# EAGLE schematic GEWI-base (EAGLE 7.6.0)
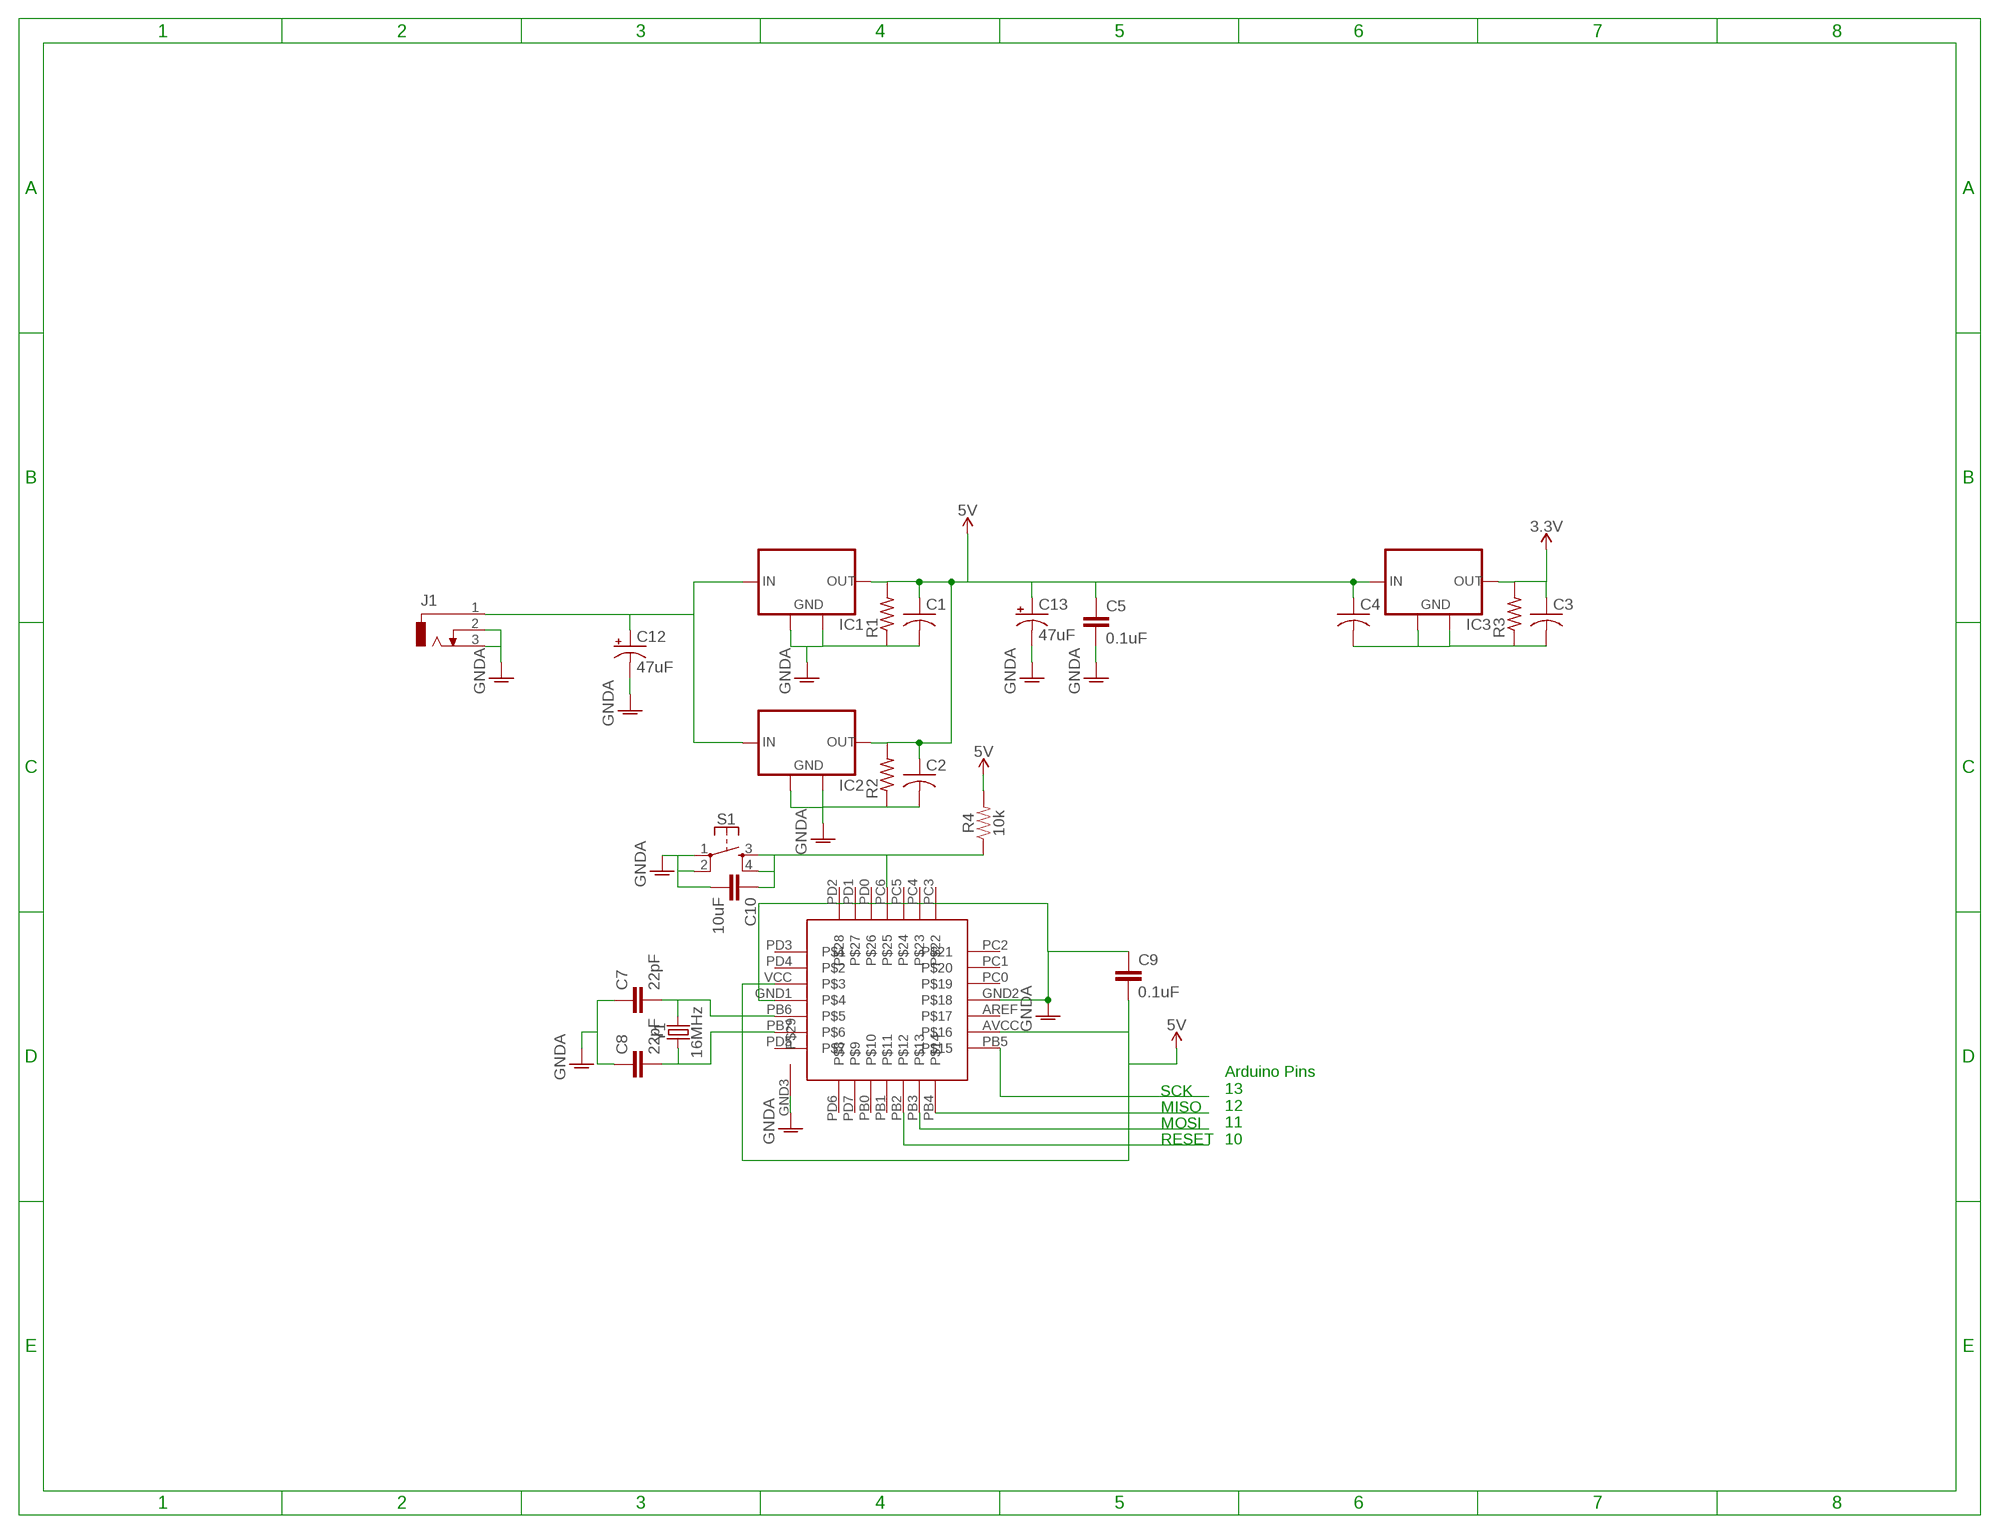
[diagram p0: schematic, sheet 1]

## Parts
C1  C-USC0603  [C0603]
C2  C-USC0603  [C0603]
C3  C-USC0603  [C0603]
C4  C-USC0603  [C0603]
C5  0.1uF  0.1UF-0603-25V-(+80/-20%)  [0603]
C7  22pF  22PF-0603-50V-5%  [0603]
C8  22pF  22PF-0603-50V-5%  [0603]
C9  0.1uF  0.1UF-0603-25V-(+80/-20%)  [0603]
C10  10uF  10UF-0603-6.3V-20%  [0603]
C12  47uF  47UF-POLAR-PANASONIC_D-35V-20%  [PANASONIC_D]
C13  47uF  47UF-POLAR-PANASONIC_D-35V-20%  [PANASONIC_D]
IC1  MCP1825S-SOT223  [SOT223]
IC2  MCP1825S-SOT223  [SOT223]
IC3  MCP1825S-SOT223  [SOT223]
J1  DCJ0303  [DCJ0303]
R1  R-US_R0603  [R0603]
R2  R-US_R0603  [R0603]
R3  R-US_R0603  [R0603]
R4  10k  10KOHM-0603-1/10W-1%  [0603]
S1  MOMENTARY-SWITCH-SPST-2-SMD-4.6X2.8MM  [TACTILE_SWITCH_SMD_4.6X2.8MM]
U1  ATMEGA328P-VQFN  [ATMEGA328P-VQFN]
Y1  16MHz  CRYSTAL-16MHZSMD-5X3.2  [CRYSTAL-SMD-5X3.2-4PAD]

## Nets
3.3V: C3.1 IC3.3(OUT) R3.2
5V: C1.1 C2.1 C4.1 C5.1 C9.2 C13.+ IC1.3(OUT) IC2.3(OUT) IC3.1(IN) R1.2 R2.2 R4.2 U1.AVCC U1.VCC
GNDA: C1.2 C2.2 C5.2 C7.1 C8.1 C9.1 C10.2 C12.- C13.- IC1.2(GND) IC1.4(GND) IC2.2(GND) IC2.4(GND) J1.2 J1.3 R1.1 R2.1 S1.1 S1.2 U1.GND1 U1.GND2 U1.GND3
N$1: C7.2 U1.PB6 Y1.3
N$2: U1.PB5
N$3: U1.PB4
N$4: U1.PB3
N$5: U1.PB2
N$7: C8.2 U1.PB7 Y1.1
N$8: C10.1 R4.1 S1.3 S1.4 U1.PC6
N$11: C12.+ IC1.1(IN) IC2.1(IN) J1.1
N$15: C3.2 C4.2 IC3.2(GND) IC3.4(GND) R3.1
Unconnected: U1.PB0 U1.PB1 U1.PC0 U1.PC1 U1.PC2 U1.PC3 U1.PC4 U1.PC5 U1.PD0 U1.PD1 U1.PD2 U1.PD3 U1.PD4 U1.PD5 U1.PD6 U1.PD7

## Notes on the sheet
- SCK
- MISO
- MOSI
- RESET
- Arduino Pins
  13
  12
  11
  10

## Power pins joined to a net without a drawn wire
P$17: U1.AREF

## Library data of the parts
C1-C4 = resistor:C-US: CAPACITOR, American symbol
C5 C9 = SparkFun-Capacitors:0.1UF: 0.1µF ceramic capacitors A capacitor is a passive two-terminal electrical component used to store electrical energy temporarily in an electric field.; PROD_ID: CAP-00810
C7 C8 = SparkFun-Capacitors:22PF: 22pF ceramic capacitors A capacitor is a passive two-terminal electrical component used to store electrical energy temporarily in an electric field.; PROD_ID: CAP-07876
C10 = SparkFun-Capacitors:10UF: 10.0µF ceramic capacitors A capacitor is a passive two-terminal electrical component used to store electrical energy temporarily in an electric field.; PROD_ID: CAP-11015
C12 C13 = SparkFun-Capacitors:47UF-POLAR: 47µF polarized capacitors A capacitor is a passive two-terminal electrical component used to store electrical energy temporarily in an electric field.; PROD_ID: CAP-08478
IC1-IC3 = Particle:MCP1825S: 500 mA, Low Voltage, Low Quiescent Current LDO Regulator
J1 = con-jack:DCJ0303: DC POWER JACK Source: DCJ0303.pdf; OC_FARNELL: unknown; OC_NEWARK: unknown
R1-R3 = resistor:R-US_: RESISTOR, American symbol
R4 = SparkFun-Resistors:10KOHM: 10kΩ resistor A resistor is a passive two-terminal electrical component that implements electrical resistance as a circuit element. Resistors act to reduce current flow, and, at the same time, act to lower voltage levels within circuits. - Wikipedia; PROD_ID: RES-00824
S1 = SparkFun-Switches:MOMENTARY-SWITCH-SPST-2: Momentary Switch (Pushbutton) - SPST - Two Circuits Normally-open (NO) SPST momentary switches (buttons, pushbuttons). Schematic symbol includes two switch circuits. Variants SMD-4.6MMX2.8MM - 4.60mm x 2.80mm Tactile Momentary Button Switch - Used on SparkFun SAMD21 Mini Breakout <https://www.sparkfun.com/products/13664> SMD-5.2MM - Mini Pushbutton Switch - SMD <https://www.sparkfun.com/products/8720> - Used on Arduino Pro Mini <https://www.sparkfun.com/products/11114>; PROD_ID: SWCH-13065
U1 = GEWI:ATMEGA328P-VQFN: ATMega328P-28 VQFN
Y1 = SparkFun-Clocks:CRYSTAL-16MHZ: 16MHz Crystal Digikey Example <http://www.digikey.com/product-search/en?keywords=535-9122-1-ND> Frequency: 16MHz Frequency Stability: ±50ppm Frequency Tolerance: ±20ppm Load Capacitance: 18pF SparkFun Products: Pro Micro -5V/16MHz <https://www.sparkfun.com/products/12640> SparkFun Serial Enabled LCD Kit <https://www.sparkfun.com/products/10097>; PROD_ID: XTAL-08218; SF_ID: COM-00094